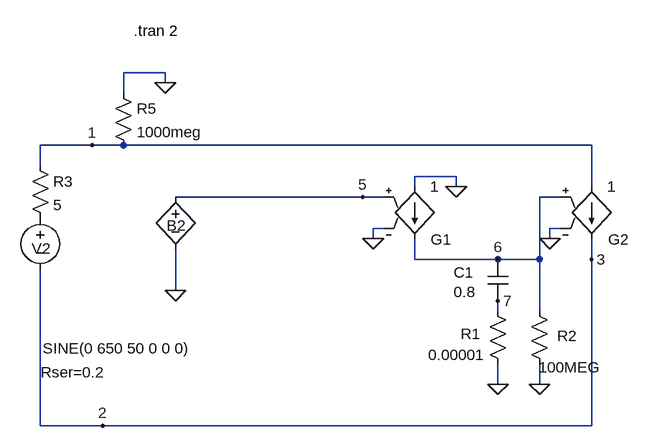
[diagram p0: schematic TransformerNonLinearModel.asc]
TransformerNonLinearModel.asc, the LTspice schematic file:
Version 4
SHEET 1 1344 692
WIRE 240 240 240 208
WIRE 240 640 240 400
WIRE 320 208 240 208
WIRE 336 640 240 640
WIRE 368 128 368 96
WIRE 368 208 320 208
WIRE 432 96 368 96
WIRE 432 112 432 96
WIRE 448 432 448 368
WIRE 736 288 448 288
WIRE 752 352 752 336
WIRE 768 288 736 288
WIRE 768 336 752 336
WIRE 816 272 816 256
WIRE 816 384 816 352
WIRE 880 256 816 256
WIRE 880 272 880 256
WIRE 944 384 816 384
WIRE 944 464 944 448
WIRE 944 576 944 544
WIRE 1008 384 944 384
WIRE 1008 384 1008 288
WIRE 1008 464 1008 384
WIRE 1008 576 1008 544
WIRE 1024 352 1024 336
WIRE 1040 288 1008 288
WIRE 1040 336 1024 336
WIRE 1088 208 368 208
WIRE 1088 272 1088 208
WIRE 1088 384 1088 352
WIRE 1088 640 336 640
WIRE 1088 640 1088 384
FLAG 1088 384 3
FLAG 336 640 2
FLAG 880 272 0
FLAG 1024 352 0
FLAG 752 352 0
FLAG 944 384 6
FLAG 448 432 0
FLAG 320 208 1
FLAG 944 448 7
FLAG 736 288 5
FLAG 944 576 0
FLAG 1008 576 0
FLAG 432 112 0
SYMBOL g2 1088 368 M180
WINDOW 0 26 15 Left 0
SYMATTR InstName G2
SYMATTR Value 1
SYMBOL g2 816 368 M180
WINDOW 0 25 15 Left 0
SYMATTR InstName G1
SYMATTR Value 1
SYMBOL cap 928 384 R0
WINDOW 0 -52 20 Left 0
WINDOW 3 -52 50 Left 0
SYMATTR InstName C1
SYMATTR Value 0.8
SYMBOL res 928 448 R0
WINDOW 0 -41 51 Left 0
WINDOW 3 -91 83 Left 0
SYMATTR InstName R1
SYMATTR Value 0.00001
SYMBOL res 992 448 R0
WINDOW 0 43 54 Left 0
WINDOW 3 15 102 Left 0
SYMATTR InstName R2
SYMATTR Value 100MEG
SYMBOL bv 448 272 R0
WINDOW 0 16 60 Right 0
WINDOW 3 24 104 Invisible 0
SYMATTR InstName B2
SYMATTR Value V=V(1, 2)/table( ABS( I(G2)) , (0, 1.0 ), (1, 0.874 ),  (2, 0.678),  (3, 0.278) ,(4, 0.126), (10,0.05), (100, 0.004))
SYMBOL voltage 240 304 R0
WINDOW 123 0 0 Left 0
WINDOW 39 1 254 Left 0
WINDOW 3 4 217 Left 0
WINDOW 0 -13 63 Left 0
SYMATTR SpiceLine Rser=0.2
SYMATTR Value SINE(0 650 50 0 0 0)
SYMATTR InstName V2
SYMBOL res 352 112 R0
SYMATTR InstName R5
SYMATTR Value 1000meg
SYMBOL res 224 224 R0
SYMATTR InstName R3
SYMATTR Value 5
TEXT 384 32 Left 0 !.tran 2

The netlist it stands for:
* TransformerNonLinearModel.asc
G2 1 2 6 0 1
G1 0 6 5 0 1
C1 6 7 0.8
R1 7 0 0.00001
R2 6 0 100MEG
B2 5 0 V=V(1, 2)/table( ABS( I(G2)) , (0, 1.0 ), (1, 0.874 ),  (2, 0.678),  (3, 0.278) ,(4, 0.126), (10,0.05), (100, 0.004))
V2 P001 2 SINE(0 650 50 0 0 0) Rser=0.2
R5 0 1 1000meg
R3 1 P001 5
.tran 2
.backanno
.end